# Altium schematic sheet [Acoustics] Super_Micro.SchDoc
size A; SheetNumber: 5; SheetTotal: 5
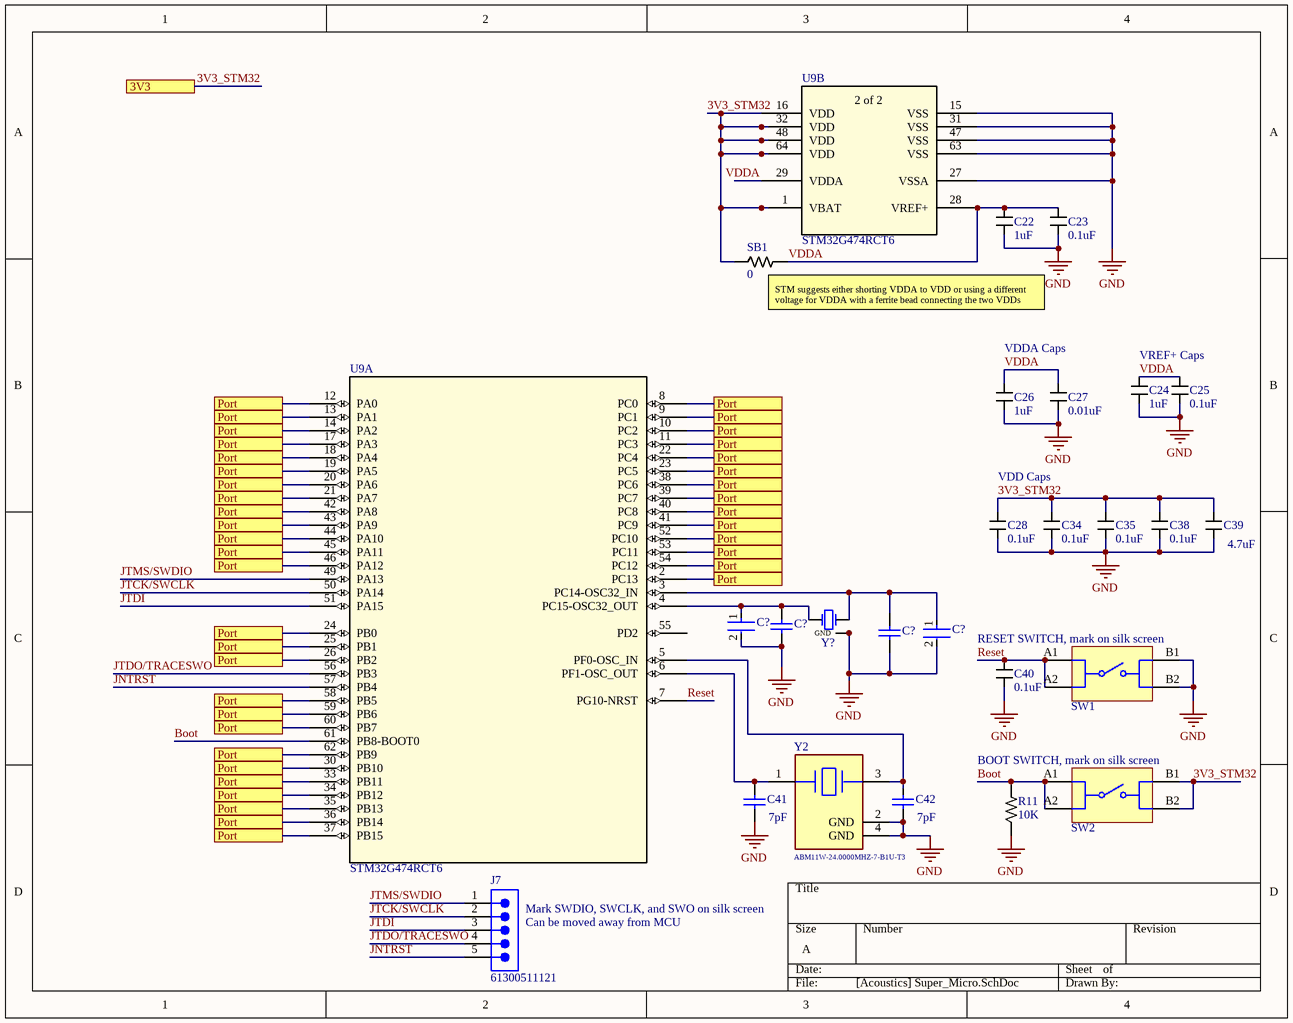
[diagram p0: [Acoustics] Super_Micro.SchDoc]

## Parts
(Parts that share a designator on the sheet are numbered #1, #2 ... from top to bottom, then left to right.)
C22  value 1uF  [CAPACITOR_0402]  (hidden comment: 1uF Ceramic 16V)
C23  value 0.1uF  [CAPACITOR_0402]  (hidden comment: 100nF Ceramic 25V)
C24  value 1uF  [CAPACITOR_0402]  (hidden comment: 1uF Ceramic 16V)
C25  value 0.1uF  [CAPACITOR_0402]  (hidden comment: 100nF Ceramic 25V)
C26  value 1uF  [CAPACITOR_0402]  (hidden comment: 1uF Ceramic 16V)
C27  value 0.01uF  [CAPACITOR_0603]  (hidden comment: 10nF Ceramic 6.3V)
C28  value 0.1uF  [CAPACITOR_0402]  (hidden comment: 100nF Ceramic 25V)
C34  value 0.1uF  [CAPACITOR_0402]  (hidden comment: 100nF Ceramic 25V)
C35  value 0.1uF  [CAPACITOR_0402]  (hidden comment: 100nF Ceramic 25V)
C38  value 0.1uF  [CAPACITOR_0402]  (hidden comment: 100nF Ceramic 25V)
C39  value 4.7uF  [CAPACITOR_0603]  (hidden comment: 4.7uF Ceramic 6.3V)
C40  value 0.1uF  [CAPACITOR_0402]  (hidden comment: 100nF Ceramic 25V)
C41  value 7pF  [CAPC1005X56X25LL10T15]  (hidden comment: 04025A7R0CAT2A)
C42  value 7pF  [CAPC1005X56X25LL10T15]  (hidden comment: 04025A7R0CAT2A)
C?#1  GCM1555C1H110FA16D  [FP-GCM155-0_05-IPC_B]  (value not drawn)
C?#2  GCM1555C1H110FA16D  [FP-GCM155-0_05-IPC_B]  (value not drawn)
C?#3  CC0402JRNPO9BN100  [CAPC1005X55X25ML05T05]  (value not drawn)
C?#4  CC0402JRNPO9BN100  [CAPC1005X55X25ML05T05]  (value not drawn)
J7  61300511121  [61300511121]
R11  Value  (Ohms): 10K  [RESISTOR_0603]  (hidden comment: 10k Ohm 5% 1/10W)
SB1  Value  (Ohms): 0  [RESISTOR_0603]  (hidden comment: 0 Ohm Jumper No Fit)
SW1  434123025826  [SMD_434123025826]  (value not drawn)
SW2  434123025826  [SMD_434123025826]  (value not drawn)
U9  STM32G474RCT6  [LQFP64-10x10mm]  (parts A,B of 2)
Y2  ABM11W-24.0000MHZ-7-B1U-T3  [FP-ABM11W-MFG]
Y?  XTAL OSC XO 32.7680KHZ 15 pF CMOS SMD  [4-SMD, NO LEAD CRYSTAL 3.2x2.5mm]  (value not drawn)

## Ports
3V3, Port

## Nets
GND: C22.2 C23.2 C24.2 C25.2 C26.2 C27.2 C28.2 C34.2 C35.2 C38.2 C39.2 C40.2 C41.1 C42.1 C?#1.2 C?#2.2 C?#3.1 C?#4.1 R11.2 SW1.B1 SW1.B2 U9.15(VSS) U9.27(VSSA) U9.31(VSS) U9.47(VSS) U9.63(VSS) Y2.2(GND) Y2.4(GND) Y?.1(GND) Y?.3
3V3_STM32: C28.1 C34.1 C35.1 C38.1 C39.1 SB1.2 SW2.B1 SW2.B2 U9.1(VBAT) U9.16(VDD) U9.32(VDD) U9.48(VDD) U9.64(VDD) ; port 3V3
Boot: R11.1 SW2.A1 SW2.A2 U9.61(PB8-BOOT0)
JNTRST: J7.5 U9.57(PB4)
JTCK/SWCLK: J7.2 U9.50(PA14)
JTDI: J7.3 U9.51(PA15)
JTDO/TRACESWO: J7.4 U9.56(PB3)
JTMS/SWDIO: J7.1 U9.49(PA13)
Port: U9.2(PC13) U9.8(PC0) U9.9(PC1) U9.10(PC2) U9.11(PC3) U9.12(PA0) U9.13(PA1) U9.14(PA2) U9.17(PA3) U9.18(PA4) U9.19(PA5) U9.20(PA6) U9.21(PA7) U9.22(PC4) U9.23(PC5) U9.24(PB0) U9.25(PB1) U9.26(PB2) U9.30(PB10) U9.33(PB11) U9.34(PB12) U9.35(PB13) U9.36(PB14) U9.37(PB15) U9.38(PC6) U9.39(PC7) U9.40(PC8) U9.41(PC9) U9.42(PA8) U9.43(PA9) U9.44(PA10) U9.45(PA11) U9.46(PA12) U9.52(PC10) U9.53(PC11) U9.54(PC12) U9.58(PB5) U9.59(PB6) U9.60(PB7) U9.62(PB9) ; port Port
Reset: C40.1 SW1.A1 SW1.A2 U9.7(PG10-NRST)
VDDA: C22.1 C23.1 C24.1 C25.1 C26.1 C27.1 SB1.1 U9.28(VREF+) U9.29(VDDA)
NetC41_2: C41.2 U9.6(PF1-OSC_OUT) Y2.1
NetC42_2: C42.2 U9.5(PF0-OSC_IN) Y2.3
NetC?#1_1: C?#1.1 C?#3.2 U9.4(PC15-OSC32_OUT) Y?.2
NetC?#2_1: C?#2.1 C?#4.2 U9.3(PC14-OSC32_IN) Y?.4

Not connected (* = marked no-connect by the designer): U9 55(PD2)

## Notes on the sheet
- (near SB1) STM suggests either shorting VDDA to VDD or using a different voltage for VDDA with a ferrite bead connecting the two VDDs
- VDDA Caps
- VREF+ Caps
- VDD Caps
- RESET SWITCH, mark on silk screen
- (near SW2) BOOT SWITCH, mark on silk screen
- (near J7) Mark SWDIO, SWCLK, and SWO on silk screen
- (near J7) Can be moved away from MCU
- (in symbol STM32G474RCT6, part B) 2 of 2

## Library data of the parts
C22 C24 C26 = CAPACITOR_1uF_0402: Cap 1uF 16V +/-10% / Ceramic 0402; Made By: Robert Pafford; Tolerance: +/- 10%; Voltage: 16V; Supplier 1: Digi-Key; Supplier Part Number 1: 478-0402YD105KAT4ADKR-ND
C23 C25 C28 C34 C35 C38 C40 = CAPACITOR_0.1uF_0402: Cap 100nF 25V +/-10% / Ceramic 0402; Made By: Robert Pafford; Tolerance: +/- 10%; Voltage: 25V; Supplier 1: Future Electronics; Supplier Part Number 1: 7029569
C27 = CAPACITOR_0.01uF_0603: Cap 10nF 6.3V +/-20% / Ceramic 0603; Tolerance: +/- 10%; Made By: Flip B; ComponentLink1Description: Datsheet; ComponentLink1URL: https://www.mouser.com/datasheet/2/212/KEM_C1002_X7R_SMD-1102033.pdf; Voltage: 6.3V; Supplier 1: Mouser; Supplier Part Number 1: 80-C0603C103K9R
C39 = CAPACITOR_4.7uF_0603: Cap 4.7uF 6.3V +/-10% / Ceramic 0603; Made By: Robert Pafford; Tolerance: +/- 10%; Voltage: 6.3V; Supplier 1: Digi-Key; Supplier Part Number 1: 1276-2087-1-ND
C41 C42 = CMP-2008-02683-1: Manufacturer: AVX Interconnect / Elco; Part Number: 04025A7R0CAT2A
C?#1 C?#2 = CMP-06035-004581-1: Ceramic Capacitor for Automotive 11pF ±1% 50VDC C0G 0402 Paper T/R
C?#3 C?#4 = CMP-2100-03589-1: Chip Capacitor, 10 pF, +/- 5%, 50 V, -55 to 125 degC, 0402 (1005 Metric), RoHS, Tape and Reel; Manufacturer: Yageo; Insulation Resistance: 100GR; Voltage Rating (DC): 50V; Dielectric Material: Ceramic; Temperature Coefficient: 30ppm/degC; Dielectric: C0G; Capacitance: 10pF; Termination: SMD/SMT; Package Reference: 0402; Lead Free: LeadFree; Composition: Ceramic; Tolerance: 5%; Case Code (Metric): 1005; Voltage Rating: 50V; Packaging: TapeandReel; Manufacturer URL: http://www.yageo.com/; REACH SVHC: NoSVHC; Max Operating Temperature: 125degC; Length: 1mm; Mount: SurfaceMount; Depth: 0.5mm; Min Operating Temperature: -55degC; Number of Pins: 2; Width: 0.02inch; Datasheet Version: Rev. 14, 07/2016; Package Quantity: 1; Datasheet URL: http://www.yageo.com/documents/recent/UPY-GP_NP0_16V-to-50V_14.pdf; Case Code (Imperial): 0402; RoHSCompliant: True; Radiation Hardening: No; Height: 0.5mm; Case/Package: 0402; Thickness: 0.022inch; Package Description: 2-Pin Surface Mount Device, Body 1 x 0.5 mm; Voltage: 50V
J7 = CMP-1502-01068-3: NexarPartId: 32855526; Connector Type: Male Pin; Gender: Male; Contact Resistance: 20mΩ; Pitch: 2.54mm; Operating Supply Voltage: 250V; Current Rating: 3A; Number of Contacts: 5; Lead Free: Lead Free; Color: Black; Packaging: Bulk; Lead Pitch: 2.54mm; Contact Material: Copper; Min Operating Temperature: -40°C; Contact Mating Length: 5.9944mm; Voltage Rating: 250V; Number of Pins: 5; Number of Positions: 5; Height: 8.89mm; Orientation: Vertical; REACH SVHC: Unknown; RoHS: Compliant; Contact Plating: Gold; Max Operating Temperature: 105°C; Mount: Through Hole; Number of Rows: 1; Termination: Solder
R11 = RESISTOR_10K_0603: RES 10k OHM 5% 1/10W 0603; Tolerance: +/- 5%; Wattage: 1/8W; Made By: Robert Pafford; ComponentLink1Description: Datasheet; ComponentLink1URL: https://www.bourns.com/docs/product-datasheets/CRxxxxx.pdf; Supplier: Digikey; Digikey Part Numer: CR0603-JW-104ELFTR-ND; Supplier 1: Digi-Key; Supplier Part Number 1: 2019-RK73B1JTTD103JCT-ND
SB1 = JUMPER_0_0603: 0 Ohm Jumper No Fit for Solder Bridge; Made By: Robert Pafford; ComponentLink1Description: Digikey; ComponentLink1URL: https://www.digikey.com/en/products/detail/koa-speer-electronics-inc/RK73B1JTTD101J/9844701
SW1 SW2 = Tactile Switch SMD: WS-TASV J-Bend SMT Tact Switch, SPST-NO, 16VDC, 50mA, 260g; Manufacturer: Wurth Elektronik; Washable: No; ComponentLink1Description: Website Link; ComponentLink1URL: https://www.we-online.com/redexpert/article/434123025826?ad; ComponentLink2Description: Datasheet Link; ComponentLink2URL: https://www.we-online.com/redexpert/spec/434123025826?ad; Manufacturer Part Number: 434123025826; Category: Tact Switches; Match Code: WS-TASV; Mount: Surface Mount; Operating Temperature Max: 85°C; Operating Temperature Min: -40°C; Packaging: Tape and Reel; Length: 4.2mm; Width: 3.2mm; Height: 2.5mm; Circuit: SPST-NO; Contact Material: Stainless Steel; Contact Plating: Silver; Operation Force: 260g; Rated Current: 50mA; Rated Voltage: 16VDC; Terminal Material: Copper Alloy; Terminal Plating: Silver; Supplier 1: Mouser; Supplier Part Number 1: 710-434123025826
U9 = STM32G474RCT6: No Description Available; Mfr_Name: STMicroelectronics; RefDes: RefDes; Type: Type
Y2 = CMP-27762-000556-1: Crystal 24MHz ±10ppm 7pF SMD-4 2mm x 1.6mm; RoHS Compliant: Yes
Y? = CRYSTAL_32.786kHz_SMD_SMALL: 32.768 kHz XO (Standard) CMOS Oscillator 1.62V ~ 3.63V Enable/Disable 4-SMD, No Lead; Value: 32.768; Capacitance: 15 pF